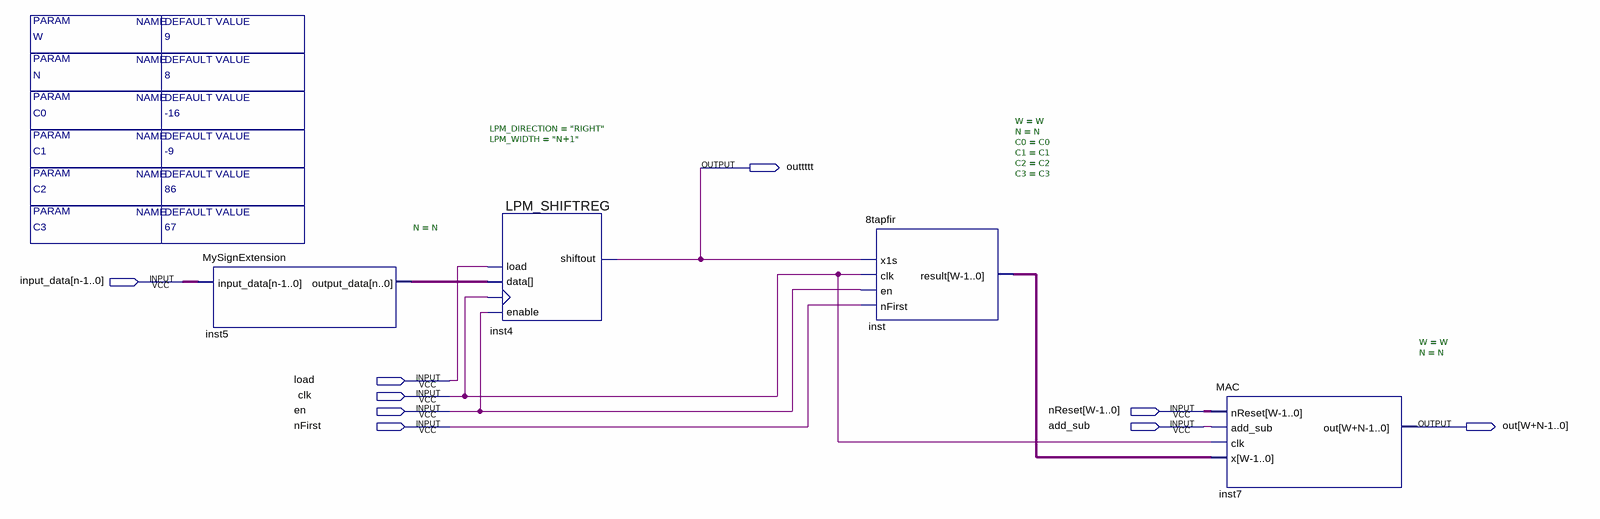
[diagram p0: schematic sheet]
// Quartus schematic Filter_1.bdf as structural Verilog: 4 symbols, 9 pins
module Filter_1 #(parameter C0 = -16, parameter C1 = -9, parameter C2 = 86, parameter C3 = 67, parameter N = 8, parameter W = 9) (
  input  [7:0] input_data,
  input  load,
  input  clk,
  input  en,
  input  [8:0] nReset,
  input  nFirst,
  input  add_sub,
  output outtttt,
  output [16:0] out
);

  wire [8:0] inst5_output_data, inst_result;

  MySignExtension #(.N(N)) inst5 (.input_data(input_data), .output_data(inst5_output_data));
  LPM_SHIFTREG #(.LPM_DIRECTION("RIGHT"), .LPM_WIDTH("N+1")) inst4 (
    .enable(en), .clock(clk), .data(inst5_output_data), .load(load), .shiftout(outtttt));
  \8tapfir  #(.W(W), .N(N), .C0(C0), .C1(C1), .C2(C2), .C3(C3)) inst (
    .x1s(outtttt), .clk(clk), .en(en), .nFirst(nFirst), .result(inst_result));
  MAC #(.W(W), .N(N)) inst7 (.nReset(nReset), .add_sub(add_sub), .clk(clk), .x(inst_result), .out(out));
endmodule
